# Altium schematic sheet Kar_IMU.SchDoc
size A; SheetNumber: 5; SheetTotal: 6
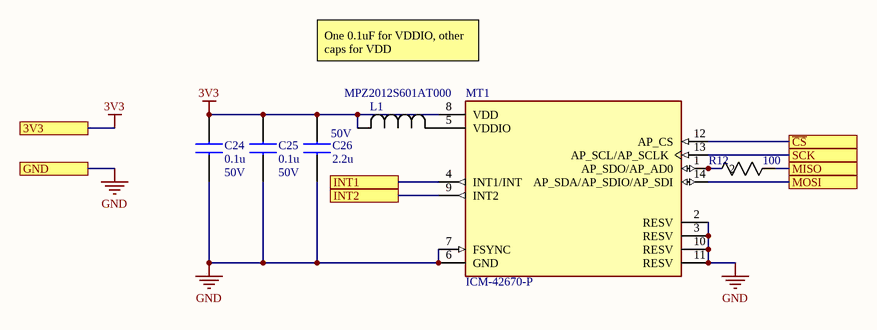
[diagram p0: Kar_IMU.SchDoc]

## Parts
C24  value 0.1u  Rated Voltage: 50V  [CAPC2012X145N]  (hidden comment: KAM21BR71H104JM)
C25  value 0.1u  Rated Voltage: 50V  [CAPC2012X145N]  (hidden comment: KAM21BR71H104JM)
C26  value 2.2u  Rated Voltage: 50V  [CAPC2012X145N]  (hidden comment: C2012X7R1H225K125AE)
L1  MPZ2012S601AT000  [IND_2012_TDK]
MT1  ICM-42670-P  [XDCR_ICM-42670-P]
R12  value 100  [RC0805N_YAG]  (hidden comment: RC0805JR-07100RL)

## Ports
3V3, GND, INT1, INT2, MISO, MOSI, SCK, ~{CS}

## Nets
3V3: C24.2 C25.2 C26.2 L1.2 MT1.8(VDD) ; port 3V3
GND: C24.1 C25.1 C26.1 MT1.2(RESV) MT1.3(RESV) MT1.6(GND) MT1.7(FSYNC) MT1.10(RESV) MT1.11(RESV) ; port GND
~{CS}: MT1.12(AP_CS) ; port ~{CS}
INT1: MT1.4(INT1/INT) ; port INT1
INT2: MT1.9(INT2) ; port INT2
MISO: R12.1 ; port MISO
MOSI: MT1.14(AP_SDA/AP_SDIO/AP_SDI) ; port MOSI
SCK: MT1.13(AP_SCL/AP_SCLK) ; port SCK
NetL1_1: L1.1 MT1.5(VDDIO)
NetMT1_1: MT1.1(AP_SDO/AP_AD0) R12.2

## Notes on the sheet
- One 0.1uF for VDDIO, other caps for VDD

## Library data of the parts
C24 C25 = KAM21BR71H104JM: Multilayer Ceramic Chip Capacitors, Capacitance=0.1u; Manufacturer_Part_Number: KAM21BR71H104JM
C26 = C2012X7R1H225K125AE: Multilayer Ceramic Chip Capacitors, Capacitance=2.2u; Manufacturer_Part_Number: C2012X7R1H225K125AE
L1 = MPZ2012S601AT000: No Description Available; Manufacturer_Name: TDK; Copyright: Copyright (C) 2025 Ultra Librarian. All rights reserved.; Manufacturer_Part_Number: MPZ2012S601AT000
R12 = RC0805JR-07100RL: RES 0805 100 5% 1/8W; Manufacturer_Name: Yageo; Manufacturer_Part_Number: RC0805JR-07100RL; Tolerance: 5%
MT1 = ICM-42670-P: Package: None; Price: None; Value: *; MP: ICM-42670-P; Availability: Unavailable